# EAGLE design aepro_28C256 (EAGLE 9.4.2)
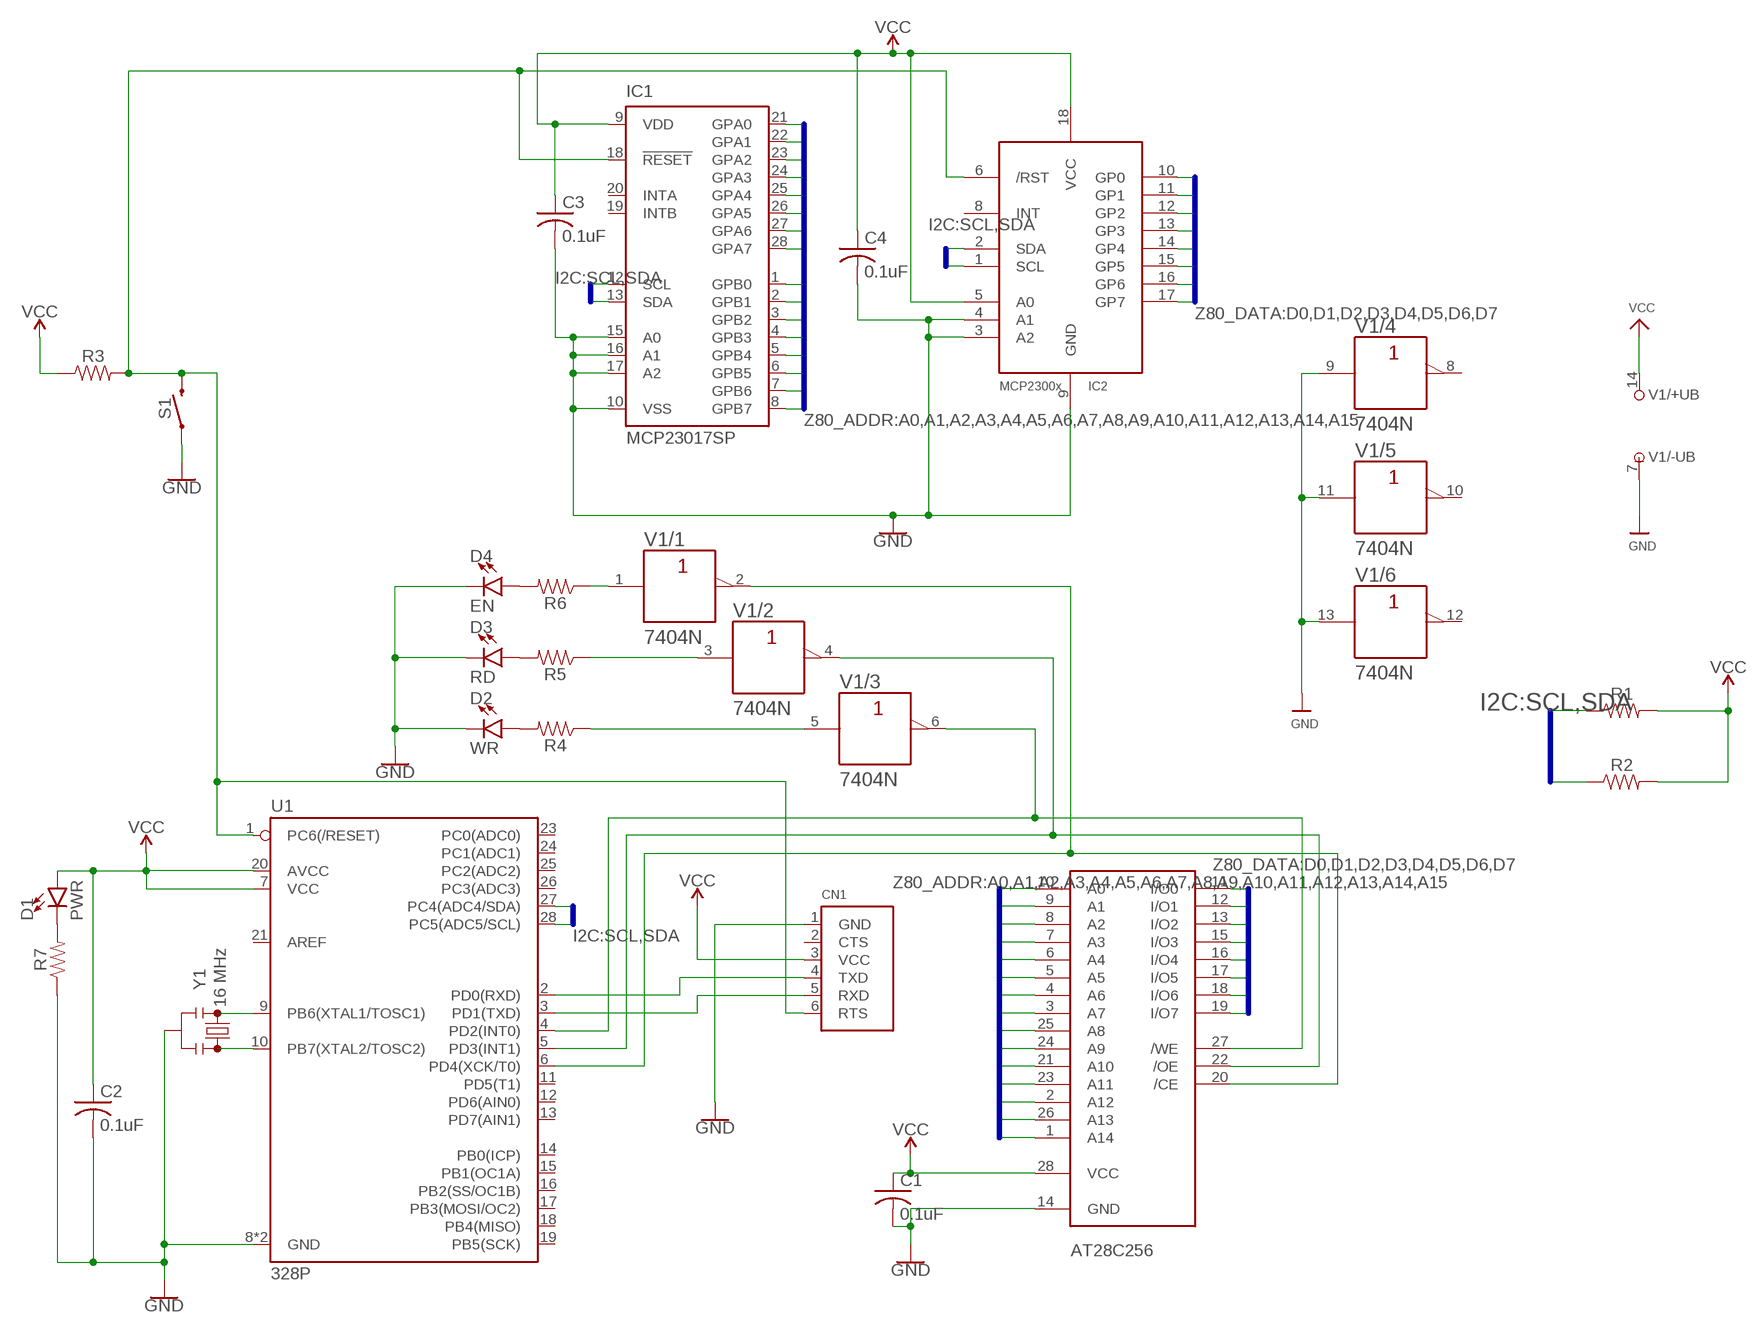
[diagram p0: schematic, sheet 1]

## Parts
C1  0.1uF  C-US050-024X044  [C050-024X044]
C2  0.1uF  C-US050-024X044  [C050-024X044]
C3  0.1uF  C-US050-024X044  [C050-024X044]
C4  0.1uF  C-US050-024X044  [C050-024X044]
CN1  FTDIUSBCABLE  [1X06_ROUND]
D1  PWR  LED3MM  [LED_3MM]
D2  WR  LED3MM  [LED_3MM]
D3  RD  LED3MM  [LED_3MM]
D4  EN  LED3MM  [LED_3MM]
IC1  MCP23017SP  [DIL28-3]
IC2  MCP23008/P  [DIL18]
R1  RESISTORAXIAL-0.3  [AXIAL-0.3]
R2  RESISTORAXIAL-0.3  [AXIAL-0.3]
R3  RESISTORAXIAL-0.3  [AXIAL-0.3]
R4  RESISTORAXIAL-0.3  [AXIAL-0.3]
R5  RESISTORAXIAL-0.3  [AXIAL-0.3]
R6  RESISTORAXIAL-0.3  [AXIAL-0.3]
R7  RESISTORAXIAL-0.3  [AXIAL-0.3]
S1  MOMENTARY-SWITCH-SPST-PTH-6.0MM  [TACTILE_SWITCH_PTH_6.0MM]
U1  328P  ATMEGA328P_PDIP  [DIP28]
U$1  AT28C256  [DIL28-6-ZIF_SOCKET]
V1  7404N  [DIL14]
Y1  16 MHz  RESONATORPTH-7.6X3.8  [RESONATOR-PTH-7.6X3.8]

## Nets
A0: IC1.21(GPA0) U$1.10(A0)
A1: IC1.22(GPA1) U$1.9(A1)
A2: IC1.23(GPA2) U$1.8(A2)
A3: IC1.24(GPA3) U$1.7(A3)
A4: IC1.25(GPA4) U$1.6(A4)
A5: IC1.26(GPA5) U$1.5(A5)
A6: IC1.27(GPA6) U$1.4(A6)
A7: IC1.28(GPA7) U$1.3(A7)
A8: IC1.1(GPB0) U$1.25(A8)
A9: IC1.2(GPB1) U$1.24(A9)
A10: IC1.3(GPB2) U$1.21(A10)
A11: IC1.4(GPB3) U$1.23(A11)
A12: IC1.5(GPB4) U$1.2(A12)
A13: IC1.6(GPB5) U$1.26(A13)
A14: IC1.7(GPB6) U$1.1(A14)
A15: IC1.8(GPB7)
CE: U1.6(PD4(XCK/T0)) U$1.20(/CE) V1.2(/1:Y)
D0: IC2.10(GP0) U$1.11(I/O0)
D1: IC2.11(GP1) U$1.12(I/O1)
D2: IC2.12(GP2) U$1.13(I/O2)
D3: IC2.13(GP3) U$1.15(I/O3)
D4: IC2.14(GP4) U$1.16(I/O4)
D5: IC2.15(GP5) U$1.17(I/O5)
D6: IC2.16(GP6) U$1.18(I/O6)
D7: IC2.17(GP7) U$1.19(I/O7)
GND: C1.2 C2.2 C3.2 C4.2 CN1.1(GND) D2.K(C) D3.K(C) D4.K(C) IC1.10(VSS) IC1.15(A0) IC1.16(A1) IC1.17(A2) IC2.3(A2) IC2.4(A1) IC2.9(GND) R7.P$1 S1.1 U1.8(GND) U1.22(GND) U$1.14(GND) V1.7(/-UB:-UB) V1.9(/4:A) V1.11(/5:A) V1.13(/6:A) Y1.2
N$1: D2.A R4.P$2
N$5: R4.P$1 V1.5(/3:A)
N$6: CN1.5(RXD) U1.3(PD1(TXD))
N$7: CN1.6(RTS) IC1.18(!RESET) IC2.6(/RST) R3.P$2 S1.3 U1.1(PC6(/RESET))
N$8: D3.A R5.P$2
N$9: D4.A R6.P$2
N$10: D1.K(C) R7.P$2
N$11: R5.P$1 V1.3(/2:A)
N$12: CN1.4(TXD) U1.2(PD0(RXD))
N$13: U1.9(PB6(XTAL1/TOSC1)) Y1.1
N$14: U1.10(PB7(XTAL2/TOSC2)) Y1.3
N$15: R6.P$1 V1.1(/1:A)
OE: U1.5(PD3(INT1)) U$1.22(/OE) V1.4(/2:Y)
SCL: IC1.12(SCL) IC2.1(SCL) R1.P$1 U1.28(PC5(ADC5/SCL))
SDA: IC1.13(SDA) IC2.2(SDA) R2.P$1 U1.27(PC4(ADC4/SDA))
VCC: C1.1 C2.1 C3.1 C4.1 CN1.3(VCC) D1.A IC1.9(VDD) IC2.5(A0) IC2.18(VCC) R1.P$2 R2.P$2 R3.P$1 U1.7(VCC) U1.20(AVCC) U$1.28(VCC) V1.14(/+UB:+UB)
WE: U1.4(PD2(INT0)) U$1.27(/WE) V1.6(/3:Y)
Unconnected: CN1.2(CTS) IC1.19(INTB) IC1.20(INTA) IC2.8(INT) U1.11(PD5(T1)) U1.12(PD6(AIN0)) U1.13(PD7(AIN1)) U1.14(PB0(ICP)) U1.15(PB1(OC1A)) U1.16(PB2(SS/OC1B)) U1.17(PB3(MOSI/OC2)) U1.18(PB4(MISO)) U1.19(PB5(SCK)) U1.21(AREF) U1.23(PC0(ADC0)) U1.24(PC1(ADC1)) U1.25(PC2(ADC2)) U1.26(PC3(ADC3)) V1.8(/4:Y) V1.10(/5:Y) V1.12(/6:Y)

## Buses
I2C:SCL,SDA
Z80_ADDR:A0,A1,A2,A3,A4,A5,A6,A7,A8,A9,A10,A11,A12,A13,A14,A15
Z80_DATA:D0,D1,D2,D3,D4,D5,D6,D7

## Library data of the parts
C1-C4 = rcl:C-US: CAPACITOR, American symbol; SPICEPREFIX: C
CN1 = microbuilder:FTDIUSBCABLE: FTDI TTL-232R USB Cable Connector for FTDI's USB->RS232 Cable
D1-D4 = SparkFun-LED:LED: LED (Generic) Standard schematic elements and footprints for 5mm, 3mm, 1206, and 0603 sized LEDs. Generic LEDs with no color specified.; PROD_ID: DIO-08794
IC1 = adafruit:MCP23017: http://ww1.microchip.com/downloads/en/DeviceDoc/21952a.pdf Source: http://ww1.microchip.com/downloads/en/DeviceDoc/21952a.pdf
IC2 = adafruit:MCP23008: MCP23008 Inexpensive i2c i/o expander - 8 general purpose i/o pins with optional pullups
R1-R7 = SparkFun-Resistors:RESISTOR: Generic Resistor Package
S1 = SparkFun-Switches:MOMENTARY-SWITCH-SPST: Momentary Switch (Pushbutton) - SPST Normally-open (NO) SPST momentary switches (buttons, pushbuttons). Variants PTH-12MM - 12mm square, through-hole Momentary Pushbutton Switch - 12mm Square <https://www.sparkfun.com/products/9190> (COM-09190) PTH-6.0MM, PTH-6.0MM-KIT - 6.0mm square, through-hole Mini Pushbutton Switch <https://www.sparkfun.com/products/97> (COM-00097) KIT package intended for soldering kit's - only one side of pads' copper is exposed. PTH-RIGHT-ANGLE-KIT - Right-angle, through-hole Right Angle Tactile Button <https://www.sparkfun.com/products/10791> - Used on SparkFun BigTime Watch Kit <https://www.sparkfun.com/products/11734> SMD-12MM - 12mm square, surface-mount Tactile Button - SMD (12mm) <https://www.sparkfun.com/products/12993> (COM-12993) Used on SparkFun PicoBoard <https://www.sparkfun.com/products/11888> SMD-4.5MM - 4.5mm Square Trackball Switch Used on SparkFun Blackberry Trackballer Breakout <https://www.sparkfun.com/products/13169> SMD-4.6MMX2.8MM - 4.60mm x 2.80mm, surface mount Used on SparkFun SAMD21 Mini Breakout <https://www.sparkfun.com/products/13664> SMD-5.2MM, SMD-5.2-REDUNDANT - 5.2mm square, surface-mount Mini Pushbutton Switch - SMD <https://www.sparkfun.com/products/8720> (COM-08720) Used on Arduino Pro Mini <https://www.sparkfun.com/products/11114> REDUNDANT package connects both switch circuits together SMD-6.0X3.5MM - 6.0 x 3.5mm, surface mount Momentary Reset Switch SMD <https://www.sparkfun.com/products/8229> (COM-08229) SMD-6.2MM-TALL - 6.2mm square, surface mount Tactile Button - SMD (6mm) <https://www.sparkfun.com/products/12992> Used on SparkFun Digital Sandbox <https://www.sparkfun.com/products/12651> SMD-RIGHT-ANGLE - Right-angle, surface mount Used on SparkFun Block for Intel® Edison - Arduino <https://www.sparkfun.com/products/13036>; PROD_ID: SWCH-08441; SF_SKU: COM-00097
U1 = SparkFun-IC-Microcontroller:ATMEGA328P_PDIP: Atmel 328P Through hole ATMEGA328P uC used in the Arduino 32kb flash, 1k EEPROM, 2k SRAM Datasheet <http://www.sparkfun.com/datasheets/Components/SMD/ATMega328.pdf> SparkFun Products Storefront component: AVR 28 Pin 20MHz 32K 6A/D - ATMega328P <https://www.sparkfun.com/products/9061> (COM-09061) SparkFun Simon Says - Through-Hole Soldering Kit <https://www.sparkfun.com/products/10547> (KIT-10547) SparkFun Learn to Solder - Simon Says <https://www.sparkfun.com/products/13708> (KIT-13708) SparkFun BigTime Watch Kit <https://www.sparkfun.com/products/11734> (KIT-11734) SparkFun ClockIt <https://www.sparkfun.com/products/10930> (KIT-10930) SparkFun Serial Enabled LCD Kit <https://www.sparkfun.com/products/10097> (LCD-10097) SparkFun Simon Tilts - Through Hole Soldering Kit <https://www.sparkfun.com/products/12634> (KIT-12634) SparkFun Frequency Counter Kit <https://www.sparkfun.com/products/10140> (KIT-10140) FabFM Radio Kit <https://www.sparkfun.com/products/11043> (KIT-11043) SparkFun Binary Blaster Kit <https://www.sparkfun.com/products/12037> (KIT-12037) SparkFun Metro-Gnome <https://www.sparkfun.com/products/9236> (KIT-09236) ATmega328 with Arduino Optiboot (Uno) <https://www.sparkfun.com/products/10524> (DEV-10524); PROD_ID: IC-09136
U$1 = wntrmute:AT28C256
V1 = 74ttl-din:74*04: Hex INVERTER
Y1 = SparkFun-Clocks:RESONATOR: Resonators (Generic) Ceramic resonators are clock-generating components, often used to control timing in microcontrollers. They usually have 3 pins: two pins for oscillation, and one pin for ground. Compared to crystals, resonators have worse tolerance, but are usually much cheaper. Plus, they have built-in load capacitors! These devices are used on boards like the Arduino Pro 8MHz <https://www.sparkfun.com/products/11114> and Arduino Pro 16MHz <https://www.sparkfun.com/products/11113>.

## Net classes
0 default: width 0.152 mm, drill 0.254 mm, clearance 0.152 mm

## Board
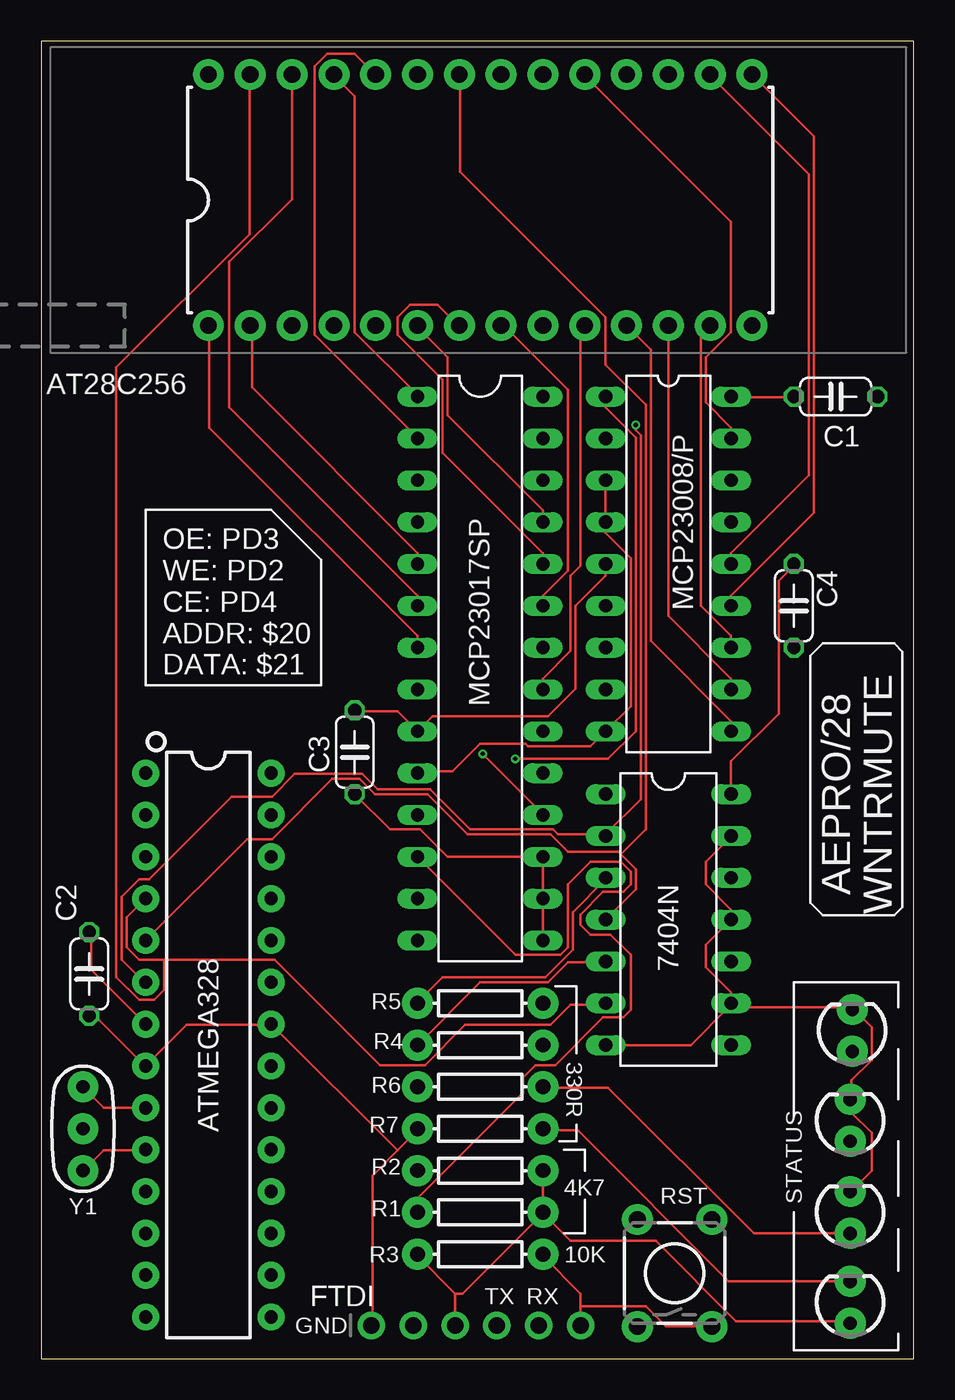
[diagram p1: board, top side]
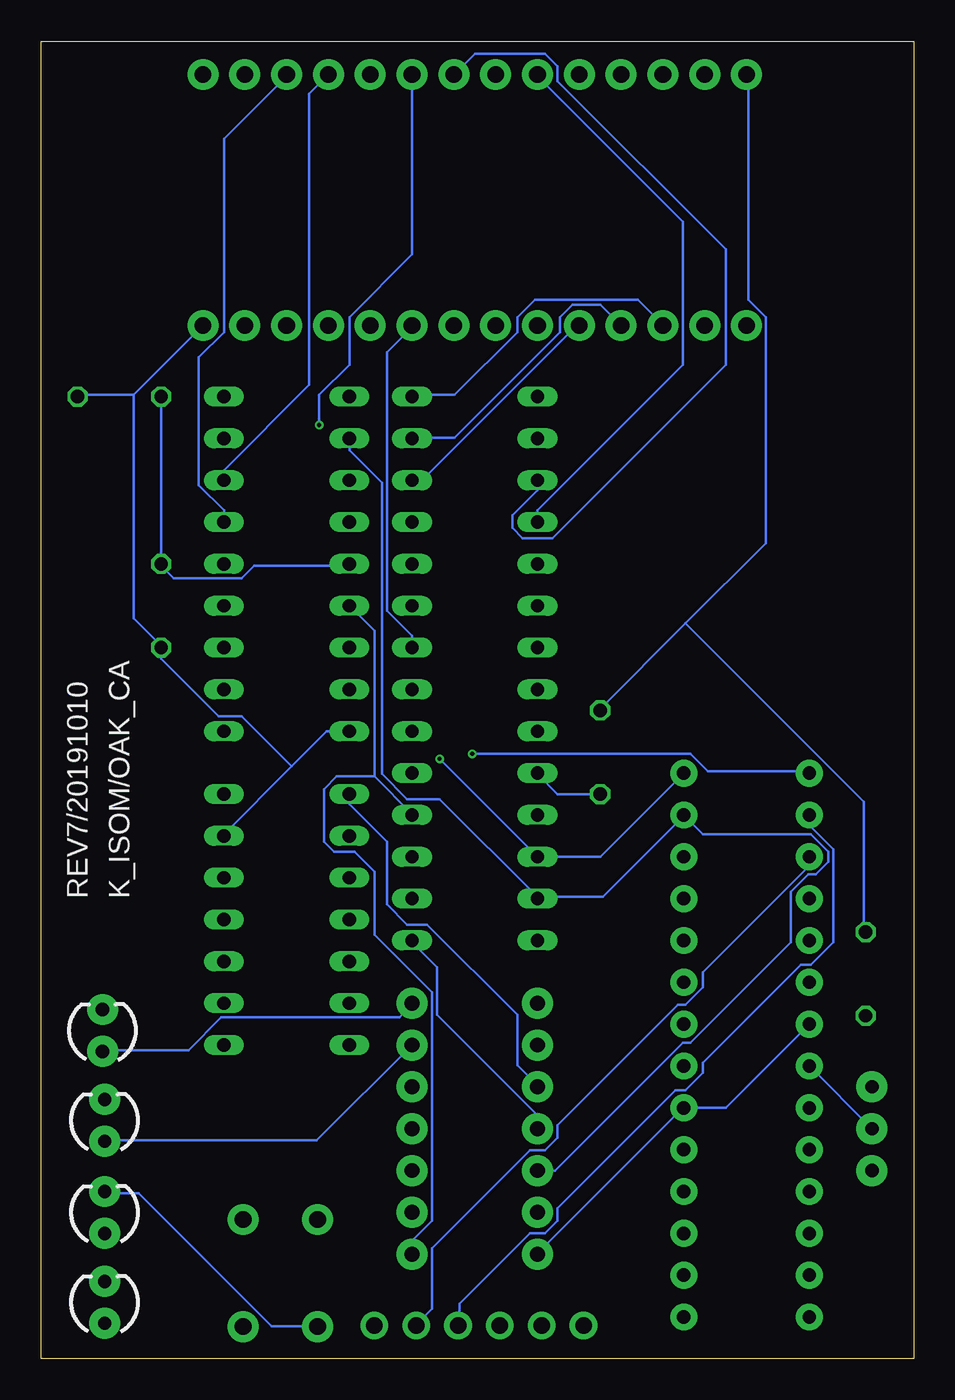
[diagram p2: board, bottom side, seen from below]

Size 53.01 x 80 mm. Coordinates in mm from the lower left corner, seen from the top.
Outline: 0,0 53.01,0 53.01,80 0,80 0,0
Copper layers (1*16): Top 0.035559375mm / dielectric 1.6mm / Bottom 0.035559375mm
Design rules "oshpark-2layer": minimum track width 6mil, minimum drill 10mil, track to track 6mil, track to pad 6mil, pad to pad 6mil, via to via 6mil, smd to smd 6mil, copper to edge 15mil, drill to drill 6mil, minimum pad ring 5mil, minimum via ring 5mil, stop-mask expansion 2.5mil, vias tented up to drill 0mil, thermal gap 10mil

### Footprints (pad centres in the part's own frame; a part is rotated, then mirrored left to right if it is on the bottom)
C050-024X044 = drill 0.813 octagon: 1 -2.54,0; 2 2.54,0
1X06_ROUND = drill 1 pad 1.676: 1 -6.35,0; 2 -3.81,0; 3 -1.27,0; 4 1.27,0; 5 3.81,0; 6 6.35,0
LED_3MM = drill 0.813 pad 1.88: A -1.27,0; K 1.27,0
DIL28-3 = drill 0.813 long: 1 -16.51,-3.81; 2 -13.97,-3.81; 3 -11.43,-3.81; 4 -8.89,-3.81; 5 -6.35,-3.81; 6 -3.81,-3.81; 7 -1.27,-3.81; 8 1.27,-3.81; 9 3.81,-3.81; 10 6.35,-3.81; 11 8.89,-3.81; 12 11.43,-3.81; 13 13.97,-3.81; 14 16.51,-3.81; 15 16.51,3.81; 16 13.97,3.81; 17 11.43,3.81; 18 8.89,3.81; 19 6.35,3.81; 20 3.81,3.81; 21 1.27,3.81; 22 -1.27,3.81; 23 -3.81,3.81; 24 -6.35,3.81; 25 -8.89,3.81; 26 -11.43,3.81; 27 -13.97,3.81; 28 -16.51,3.81
DIL18 = drill 0.813 long: 1 -10.16,-3.81; 2 -7.62,-3.81; 3 -5.08,-3.81; 4 -2.54,-3.81; 5 0,-3.81; 6 2.54,-3.81; 7 5.08,-3.81; 8 7.62,-3.81; 9 10.16,-3.81; 10 10.16,3.81; 11 7.62,3.81; 12 5.08,3.81; 13 2.54,3.81; 14 0,3.81; 15 -2.54,3.81; 16 -5.08,3.81; 17 -7.62,3.81; 18 -10.16,3.81
AXIAL-0.3 = drill 0.9 pad 1.88: P$1 -3.81,0; P$2 3.81,0
TACTILE_SWITCH_PTH_6.0MM = drill 1.016 pad 1.88: 1 -3.251,2.261; 2 3.251,2.261; 3 -3.251,-2.261; 4 3.251,-2.261
DIP28 = drill 0.813 pad 1.626: 1 -16.51,-3.81; 2 -13.97,-3.81; 3 -11.43,-3.81; 4 -8.89,-3.81; 5 -6.35,-3.81; 6 -3.81,-3.81; 7 -1.27,-3.81; 8 1.27,-3.81; 9 3.81,-3.81; 10 6.35,-3.81; 11 8.89,-3.81; 12 11.43,-3.81; 13 13.97,-3.81; 14 16.51,-3.81; 15 16.51,3.81; 16 13.97,3.81; 17 11.43,3.81; 18 8.89,3.81; 19 6.35,3.81; 20 3.81,3.81; 21 1.27,3.81; 22 -1.27,3.81; 23 -3.81,3.81; 24 -6.35,3.81; 25 -8.89,3.81; 26 -11.43,3.81; 27 -13.97,3.81; 28 -16.51,3.81
DIL28-6-ZIF_SOCKET = drill 1.016 pad 1.88: 1 -16.51,-7.62; 2 -13.97,-7.62; 3 -11.43,-7.62; 4 -8.89,-7.62; 5 -6.35,-7.62; 6 -3.81,-7.62; 7 -1.27,-7.62; 8 1.27,-7.62; 9 3.81,-7.62; 10 6.35,-7.62; 11 8.89,-7.62; 12 11.43,-7.62; 13 13.97,-7.62; 14 16.51,-7.62; 15 16.51,7.62; 16 13.97,7.62; 17 11.43,7.62; 18 8.89,7.62; 19 6.35,7.62; 20 3.81,7.62; 21 1.27,7.62; 22 -1.27,7.62; 23 -3.81,7.62; 24 -6.35,7.62; 25 -8.89,7.62; 26 -11.43,7.62; 27 -13.97,7.62; 28 -16.51,7.62
DIL14 = drill 0.813 long: 1 -7.62,-3.81; 2 -5.08,-3.81; 3 -2.54,-3.81; 4 0,-3.81; 5 2.54,-3.81; 6 5.08,-3.81; 7 7.62,-3.81; 8 7.62,3.81; 9 5.08,3.81; 10 2.54,3.81; 11 0,3.81; 12 -2.54,3.81; 13 -5.08,3.81; 14 -7.62,3.81
RESONATOR-PTH-7.6X3.8 = drill 0.8 pad 1.88: 1 -2.54,0; 2 0,0; 3 2.54,0

### Placement (x,y rotation side)
C1  48.26,58.42 0 top
C2  2.92,23.37 270 top
C3  19.05,36.83 270 top
C4  45.72,45.72 270 top
CN1  26.42,2.03 0 top
D1  49.15,3.43 90 top
D2  49.15,14.48 90 top
D3  49.28,19.94 90 top
D4  49.15,8.89 90 top
IC1  26.67,41.91 270 top
IC2  38.1,48.26 270 top
R1  26.67,8.89 0 top
R2  26.67,11.43 0 top
R3  26.67,6.35 0 top
R4  26.67,19.05 0 top
R5  26.67,21.59 0 top
R6  26.67,16.51 0 top
R7  26.67,13.97 0 top
S1  38.48,5.21 90 top
U1  10.16,19.05 270 top
U$1  26.67,70.36 0 top
V1  38.1,26.67 270 top
Y1  2.54,13.97 270 top

### Tracks (layer width: path | path; a pad name or v marks a point on that pad's centre or on a via)
A0
  Top 0.152: IC1.21 30.48,41.3 32.16,42.98 32.16,47.55 32.77,48.16 32.77,62.48 U$1.10
A1
  Bottom 0.152: IC1.22 30.48,43.89 32,45.41 32,61.11 30.48,62.64 U$1.9
A2
  Top 0.152: IC1.23 30.48,46.33 32,47.85 32,58.83 28.04,62.79 U$1.8
A3
  Top 0.152: IC1.24 30.48,48.92 24.38,55.02 24.38,59.44 21.64,62.18 21.64,63.25 22.4,64.01 24.08,64.01 25.3,62.79 U$1.7
A4
  Top 0.152: IC1.25 30.48,51.51 24.69,57.3 24.69,60.81 22.86,62.64 U$1.6
A5
  Bottom 0.152: IC1.26 29.87,53.34 20.42,62.79 U$1.5
A6
  Bottom 0.152: U$1.4 19.05,64.01 20.73,64.01 21.49,63.25 21.49,62.33 27.89,55.93 30.48,55.93 IC1.27
A7
  Bottom 0.152: IC1.28 30.48,58.52 27.89,58.52 24.08,62.33 24.08,63.25 23.01,64.31 16.76,64.31 15.24,62.79 U$1.3
A8
  Top 0.152: IC1.1 22.86,58.52 19.05,62.33 19.05,76.66 17.83,77.88 U$1.25
A9
  Top 0.152: U$1.24 19.05,79.25 17.37,79.25 16.61,78.49 16.61,62.18 22.86,55.93 IC1.2
A10
  Bottom 0.152: IC1.3 22.86,52.73 24.38,51.21 24.38,50.44 23.77,49.84 21.95,49.84 11.43,60.35 11.43,67.36 21.64,77.57 21.64,78.49 22.4,79.25 26.67,79.25 U$1.21
A11
  Bottom 0.152: IC1.4 22.86,51.51 14.02,60.35 14.02,69.04 22.86,77.88 U$1.23
A12
  Top 0.152: IC1.5 22.86,48.92 12.8,58.98 12.8,62.64 U$1.2
A13
  Top 0.152: IC1.6 22.86,46.33 11.43,57.76 11.43,66.6 15.24,70.41 U$1.26
A14
  Top 0.152: IC1.7 22.86,43.89 10.21,56.54 10.21,62.64 U$1.1
CE  (via drill 0.25)
  Top 0.152: 34.29,31.85 31.39,31.85 31.09,32.16 26.06,32.16 23.62,34.59 20.42,34.59 19.51,35.51 15.39,35.51 14.02,34.14 11.58,34.14 6.55,29.11 5.94,29.11 4.88,28.04 4.88,24.23 6.25,22.86 U1.6 | v36.12,56.69 36.12,56.39 36.42,56.08 36.42,33.98 34.29,31.85 | 34.29,31.85 V1.2
  Bottom 0.152: U$1.20 30.48,67.06 34.29,63.25 34.29,60.35 36.12,58.52 v36.12,56.69
D0
  Top 0.152: IC2.10 41.91,38.71 37.03,43.59 37.03,61.27 U$1.11
D1
  Top 0.152: IC2.11 41.91,41.3 38.1,45.11 U$1.12
D2
  Top 0.152: IC2.12 41.91,43.89 40.08,45.72 40.08,62.18 U$1.13
D3
  Top 0.152: IC2.13 41.91,46.33 46.94,51.36 46.94,74.22 U$1.15
D4
  Top 0.152: IC2.14 41.91,48.92 46.63,53.65 46.63,71.93 40.69,77.88 U$1.16
D5
  Bottom 0.152: IC2.15 41.91,51.51 43.43,53.03 43.43,60.81 41.91,62.33 41.91,74.07 38.1,77.88 U$1.17
D6
  Bottom 0.152: IC2.16 41.91,53.95 36.73,59.13 36.73,76.81 U$1.18
D7
  Top 0.152: IC2.17 41.91,56.54 40.39,58.06 40.39,60.81 41.91,62.33 41.91,69.04 33.07,77.88 U$1.19
GND
  Top 0.152: 21.64,12.65 22.86,13.87 R7.P$1 | 21.64,12.65 20.12,11.12 20.12,2.13 CN1.1 | C2.2 3.05,20.73 3.35,20.73 6.25,17.83 U1.8 8.84,20.27 13.87,20.27 U1.22 21.64,12.65 | D4.K 49.23,10.21 50.44,11.43 50.44,13.72 49.23,14.94 49.23,15.7 D2.K 49.23,15.85 49.23,16.92 50.44,18.14 50.44,20.12 49.38,21.18 D3.K 49.23,21.34 41.76,21.34 | V1.7 39.47,19.05 41.76,21.34 | 41.76,21.34 41.91,21.49 V1.9 | IC1.15 IC1.16 IC1.17 24.69,30.48 23.01,32.16 21.18,32.16 C3.2 | IC2.3 IC2.4 34.29,50.14 35.81,48.62 35.81,39.62 IC2.9 33.38,37.19 29.57,37.19 29.41,37.34 26.67,37.34 24.99,35.66 22.86,35.66 IC1.10 | V1.13 41.91,31.7 40.39,30.18 40.39,28.8 41.91,27.28 V1.11 40.39,25.15 40.39,23.77 41.91,22.25 V1.9 | 41.76,21.34 V1.9
  Bottom 0.152: U1.8 Y1.2 | S1.1 36.27,1.98 39.01,1.98 47.09,10.06 49.07,10.06 D4.K | 47.4,58.52 50.75,58.52 C1.2 | U$1.14 47.4,58.52 | C3.2 21.64,34.29 22.86,35.51 IC1.10 | IC2.9 35.66,38.1 37.8,35.97 | 37.8,35.97 41.91,31.85 V1.13 | 37.8,35.97 40.84,39.01 42.22,39.01 45.72,42.52 C4.2 45.72,43.28 47.4,44.96 47.4,58.52 | R7.P$1 22.86,14.78 28.96,20.88 28.96,23.77 30.48,25.3 IC1.15
N$1
  Bottom 0.152: R4.P$2 36.27,13.26 49.07,13.26 D2.A
N$5
  Top 0.152: R4.P$1 26.67,22.86 30.79,22.86 32,24.08 34.29,24.08 V1.5
N$6
  Bottom 0.152: U1.3 6.4,30.48 6.4,29.87 12.8,23.47 12.8,22.55 13.87,21.49 14.33,21.49 21.64,14.17 21.64,13.41 22.4,12.65 23.32,12.65 29.26,6.71 29.26,3.05 30.18,2.13 CN1.5
N$7  (via drill 0.25)
  Top 0.152: 32.77,3.2 32.77,3.96 30.48,6.25 R3.P$2 | 32.77,3.2 CN1.6 | 32.77,3.2 36.73,3.2 37.95,1.98 40.69,1.98 S1.3 | v26.82,36.73 30.48,33.07 IC1.18
  Bottom 0.152: 32.77,35.36 30.48,33.07 IC1.18 | 32.77,35.36 32.77,44.2 IC2.6 | v26.82,36.73 13.56,36.73 12.5,35.66 6.4,35.66 U1.1 | R3.P$2 30.48,7.16 29.26,8.38 29.26,22.25 32.77,25.76 32.77,29.57 33.98,30.79 35.2,30.79 35.81,31.39 35.81,34.59 35.05,35.36 32.77,35.36
N$8
  Bottom 0.152: D3.A 49.23,18.75 44.04,18.75 42.06,20.73 31.24,20.73 30.48,21.49 R5.P$2
N$9
  Top 0.152: D4.A 43.28,7.62 34.44,16.46 30.48,16.46 R6.P$2
N$10
  Top 0.152: D1.K 49.07,4.72 41.76,4.72 32.61,13.87 30.48,13.87 R7.P$2
N$11
  Top 0.152: V1.3 34.29,29.11 32.31,27.13 32.31,24.84 30.63,23.16 24.38,23.16 22.86,21.64 R5.P$1
N$12
  Bottom 0.152: U1.2 6.25,32.92 6.25,32.31 4.88,30.94 4.88,25.3 6.25,23.93 6.86,23.93 12.8,17.98 12.8,17.37 13.87,16.31 14.48,16.31 21.64,9.14 21.64,8.38 22.4,7.62 23.32,7.62 27.58,3.35 27.58,2.13 CN1.4
N$13
  Top 0.152: U1.9 3.81,15.24 Y1.1
N$14
  Top 0.152: U1.10 6.25,12.65 3.81,12.65 2.59,11.43 Y1.3
N$15
  Bottom 0.152: V1.1 34.29,33.68 32,31.39 32,27.58 30.79,26.36 29.57,26.36 24.08,20.88 24.08,17.83 22.86,16.61 R6.P$1
OE
  Top 0.152: V1.4 36.12,28.5 36.12,29.72 35.2,30.63 | 35.2,30.63 35.05,30.79 32,30.79 30.94,31.85 25.91,31.85 23.47,34.29 20.27,34.29 19.36,35.2 17.68,35.2 14.02,31.55 12.5,31.55 U1.5 | 35.2,30.63 36.73,32.16 36.73,57.91 34.29,60.35 34.29,63.25 25.45,72.08 25.45,77.88 U$1.22
SCL  (via drill 0.25)
  Top 0.152: IC2.1 34.29,57.76 36.12,55.93 36.12,38.1 34.44,36.42 v28.8,36.42 | R1.P$1 22.86,9.75 29.26,16.15 29.26,17.07 30.02,17.83 31.24,17.83 34.14,20.73 35.36,20.73 35.81,21.18 35.81,24.54 34.59,25.76 33.38,25.76 32.77,26.36 32.77,26.98 34.14,28.35 35.36,28.35 35.81,28.8 35.81,29.57 35.2,30.18 33.38,30.18 32,28.8 32,24.99 31.55,24.54 28.8,24.54 IC1.12
  Bottom 0.152: U1.28 19.05,30.48 IC1.12 v28.8,36.42
SDA
  Bottom 0.152: 22.86,28.04 18.9,28.04 14.02,32.92 U1.27 12.8,31.85 6.25,31.85 5.18,30.79 5.18,30.18 5.94,29.41 6.4,29.41 7.47,28.35 7.47,25.3 13.56,19.2 14.02,19.2 21.79,11.43 R2.P$1 | IC2.2 34.29,55.17 32.31,53.19 32.31,35.51 30.79,33.98 28.8,33.98 22.86,28.04 | 22.86,28.04 IC1.13
VCC
  Top 0.152: U1.7 3.05,23.62 3.05,25.91 C2.1 | 25.15,3.96 CN1.3 | 25.15,3.96 22.86,6.25 R3.P$1 | R2.P$2 R1.P$2 30.48,8.84 | 30.48,8.84 32.16,7.16 37.34,7.16 42.22,2.29 49.07,2.29 D1.A | 25.15,3.96 25.6,3.96 30.48,8.84 | IC2.18 41.91,58.37 45.72,58.37 C1.1 | V1.14 41.91,36.27 44.81,39.17 44.81,47.24 45.72,48.16 C4.1 | C3.1 19.05,39.32 21.64,39.32 IC1.9 23.77,39.01 30.79,39.01 32.46,40.69 32.46,45.72 34.29,47.55 IC2.5
  Bottom 0.152: U1.7 11.43,15.24 U1.20 14.02,15.24 22.86,6.4 R3.P$1 | IC2.5 34.29,48.16 40.08,48.16 40.84,47.4 44.96,47.4 45.72,48.16 C4.1 C1.1 | 13.87,44.65 19.05,39.47 C3.1 | 13.87,44.65 8.99,49.53 8.99,63.25 10.06,64.31 10.06,77.88 U$1.28 | 13.87,44.65 3.05,33.83 3.05,25.91 C2.1
WE
  Top 0.152: 7.47,24.23 5.94,24.23 5.18,24.99 5.18,26.82 6.25,27.89 U1.4 | 7.47,24.23 14.17,24.23 20.57,17.83 23.32,17.83 25.76,20.27 30.94,20.27 32.16,21.49 34.29,21.49 V1.6 | 7.47,24.23 7.47,22.4 6.86,21.79 5.94,21.79 4.57,23.16 4.57,60.2 12.65,68.28 12.65,77.88 U$1.27

### Text on the board
tPlace: AT28C256 | OE: PD3 / WE: PD2 / CE: PD4 / ADDR: $20 / DATA: $21 | AEPRO/28 | WNTRMUTE | ATMEGA328 | 330R | 4K7 | RST | STATUS | 10K | FTDI | TX | RX | GND
bPlace: K_ISOM/OAK_CA | REV7/20191010